# Altium schematic sheet CPUboard.SchDoc
size A
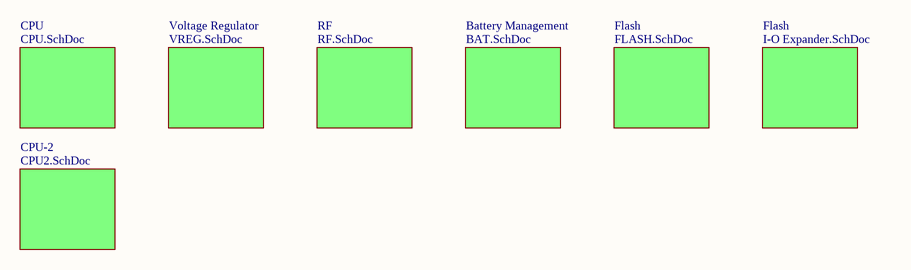
[diagram p0: CPUboard.SchDoc]

## Sub-sheets
Battery Management = BAT.SchDoc: no entries
CPU = CPU.SchDoc: no entries
CPU-2 = CPU2.SchDoc: no entries
Flash = FLASH.SchDoc: no entries
Flash = I-O Expander.SchDoc: no entries
RF = RF.SchDoc: no entries
Voltage Regulator = VREG.SchDoc: no entries